# Altium schematic sheet GS_02_Pow.SchDoc: Title
size A3; Date: Date; CompanyName: Integrated Micro-Electronics Bulgaria; Organization: Design & Development Department; Address1: Drawing Type; Address2: Address 1; Address3: Address 2; Address4: Address 3; DocumentNumber: 730xxx; Revision: 01; SheetNumber: 1; SheetTotal: 1; PageSetup: Record=PageOptions|CenterHorizontal=True|CenterVertical=True|PrintScale=0.70|XCorrection=1.00|YCorrection=1.00|PrintKind=2|BorderSize=5000000|LeftOffset=0|BottomOffset=0|Orientation=2|PaperLength=1000|PaperWidth=1000|Scale=100|PaperSource=7|PrintQuality=-4|MediaType=1|DitherType=10|PaperKind=A4|PrintScaleMode=1; SheetSize: A3; Time: Time; ModifiedDate: Mod. Date
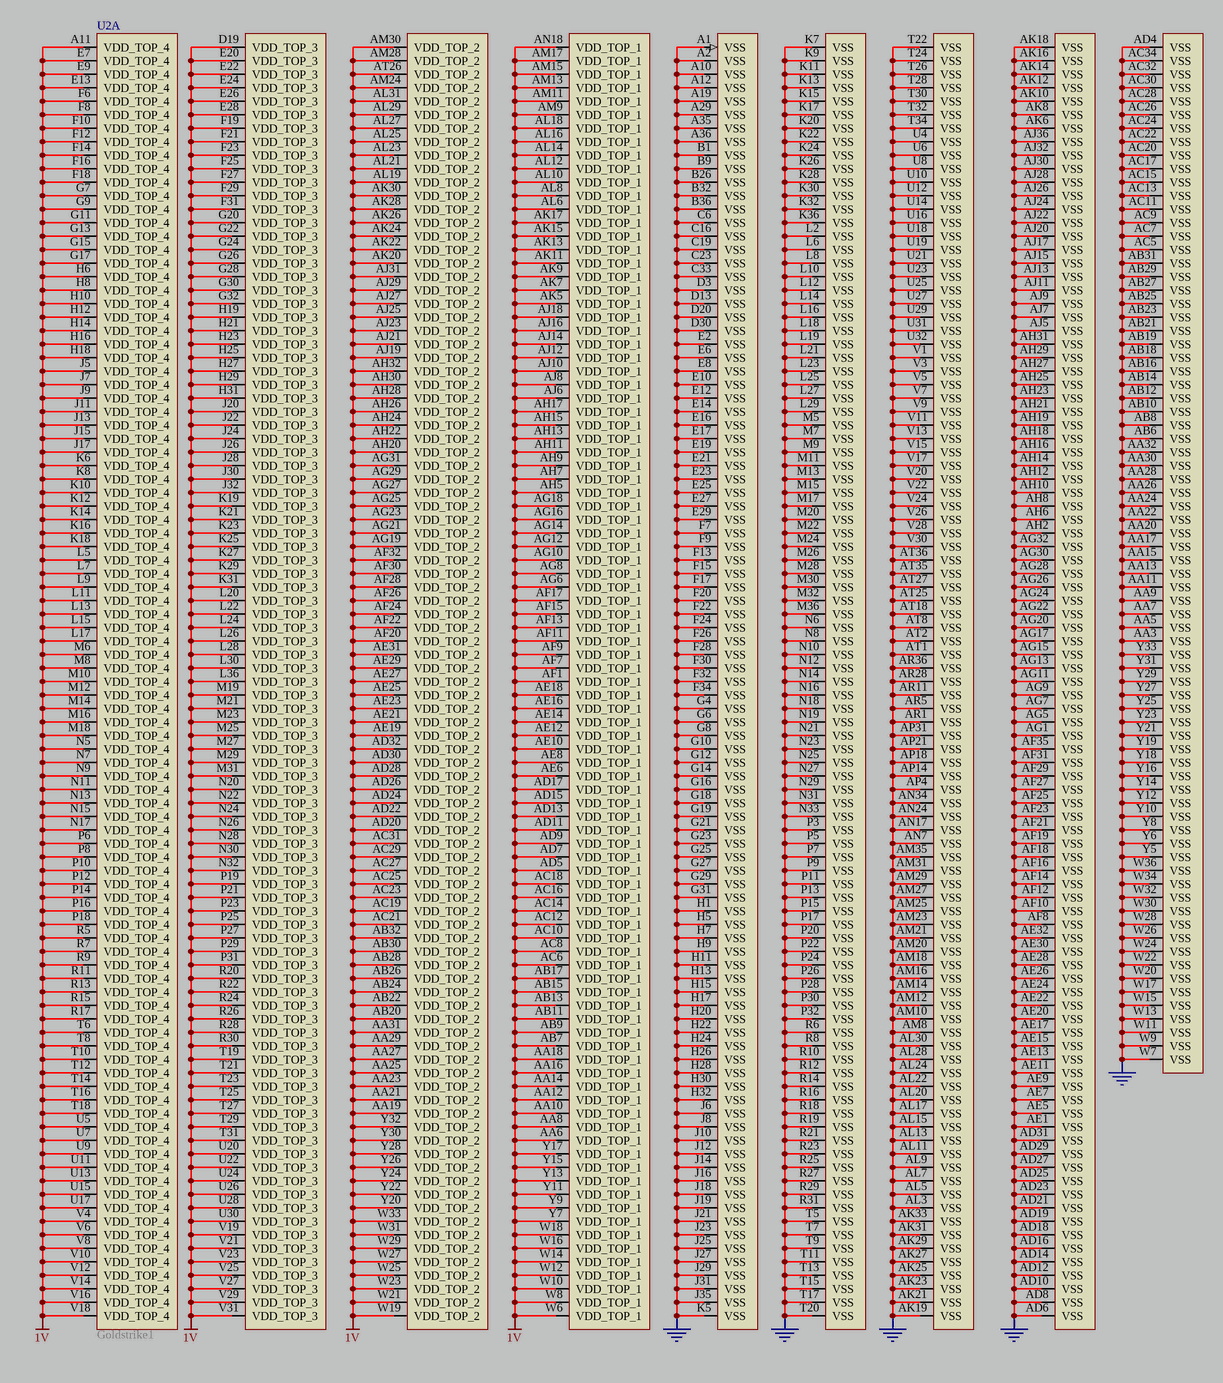
[diagram p0: GS_02_Pow.SchDoc]

## Parts
U2  Goldstrike1  (part A of 5)

## Nets
1V: U2.A11(VDD_TOP_4) U2.AA6(VDD_TOP_1) U2.AA8(VDD_TOP_1) U2.AA10(VDD_TOP_1) U2.AA12(VDD_TOP_1) U2.AA14(VDD_TOP_1) U2.AA16(VDD_TOP_1) U2.AA18(VDD_TOP_1) U2.AA19(VDD_TOP_2) U2.AA21(VDD_TOP_2) U2.AA23(VDD_TOP_2) U2.AA25(VDD_TOP_2) U2.AA27(VDD_TOP_2) U2.AA29(VDD_TOP_2) U2.AA31(VDD_TOP_2) U2.AB7(VDD_TOP_1) U2.AB9(VDD_TOP_1) U2.AB11(VDD_TOP_1) U2.AB13(VDD_TOP_1) U2.AB15(VDD_TOP_1) U2.AB17(VDD_TOP_1) U2.AB20(VDD_TOP_2) U2.AB22(VDD_TOP_2) U2.AB24(VDD_TOP_2) U2.AB26(VDD_TOP_2) U2.AB28(VDD_TOP_2) U2.AB30(VDD_TOP_2) U2.AB32(VDD_TOP_2) U2.AC6(VDD_TOP_1) U2.AC8(VDD_TOP_1) U2.AC10(VDD_TOP_1) U2.AC12(VDD_TOP_1) U2.AC14(VDD_TOP_1) U2.AC16(VDD_TOP_1) U2.AC18(VDD_TOP_1) U2.AC19(VDD_TOP_2) U2.AC21(VDD_TOP_2) U2.AC23(VDD_TOP_2) U2.AC25(VDD_TOP_2) U2.AC27(VDD_TOP_2) U2.AC29(VDD_TOP_2) U2.AC31(VDD_TOP_2) U2.AD5(VDD_TOP_1) U2.AD7(VDD_TOP_1) U2.AD9(VDD_TOP_1) U2.AD11(VDD_TOP_1) U2.AD13(VDD_TOP_1) U2.AD15(VDD_TOP_1) U2.AD17(VDD_TOP_1) U2.AD20(VDD_TOP_2) U2.AD22(VDD_TOP_2) U2.AD24(VDD_TOP_2) U2.AD26(VDD_TOP_2) U2.AD28(VDD_TOP_2) U2.AD30(VDD_TOP_2) U2.AD32(VDD_TOP_2) U2.AE6(VDD_TOP_1) U2.AE8(VDD_TOP_1) U2.AE10(VDD_TOP_1) U2.AE12(VDD_TOP_1) U2.AE14(VDD_TOP_1) U2.AE16(VDD_TOP_1) U2.AE18(VDD_TOP_1) U2.AE19(VDD_TOP_2) U2.AE21(VDD_TOP_2) U2.AE23(VDD_TOP_2) U2.AE25(VDD_TOP_2) U2.AE27(VDD_TOP_2) U2.AE29(VDD_TOP_2) U2.AE31(VDD_TOP_2) U2.AF1(VDD_TOP_1) U2.AF7(VDD_TOP_1) U2.AF9(VDD_TOP_1) U2.AF11(VDD_TOP_1) U2.AF13(VDD_TOP_1) U2.AF15(VDD_TOP_1) U2.AF17(VDD_TOP_1) U2.AF20(VDD_TOP_2) U2.AF22(VDD_TOP_2) U2.AF24(VDD_TOP_2) U2.AF26(VDD_TOP_2) U2.AF28(VDD_TOP_2) U2.AF30(VDD_TOP_2) U2.AF32(VDD_TOP_2) U2.AG6(VDD_TOP_1) U2.AG8(VDD_TOP_1) U2.AG10(VDD_TOP_1) U2.AG12(VDD_TOP_1) U2.AG14(VDD_TOP_1) U2.AG16(VDD_TOP_1) U2.AG18(VDD_TOP_1) U2.AG19(VDD_TOP_2) U2.AG21(VDD_TOP_2) U2.AG23(VDD_TOP_2) U2.AG25(VDD_TOP_2) U2.AG27(VDD_TOP_2) U2.AG29(VDD_TOP_2) U2.AG31(VDD_TOP_2) U2.AH5(VDD_TOP_1) U2.AH7(VDD_TOP_1) U2.AH9(VDD_TOP_1) U2.AH11(VDD_TOP_1) U2.AH13(VDD_TOP_1) U2.AH15(VDD_TOP_1) U2.AH17(VDD_TOP_1) U2.AH20(VDD_TOP_2) U2.AH22(VDD_TOP_2) U2.AH24(VDD_TOP_2) U2.AH26(VDD_TOP_2) U2.AH28(VDD_TOP_2) U2.AH30(VDD_TOP_2) U2.AH32(VDD_TOP_2) U2.AJ6(VDD_TOP_1) U2.AJ8(VDD_TOP_1) U2.AJ10(VDD_TOP_1) U2.AJ12(VDD_TOP_1) U2.AJ14(VDD_TOP_1) U2.AJ16(VDD_TOP_1) U2.AJ18(VDD_TOP_1) U2.AJ19(VDD_TOP_2) U2.AJ21(VDD_TOP_2) U2.AJ23(VDD_TOP_2) U2.AJ25(VDD_TOP_2) U2.AJ27(VDD_TOP_2) U2.AJ29(VDD_TOP_2) U2.AJ31(VDD_TOP_2) U2.AK5(VDD_TOP_1) U2.AK7(VDD_TOP_1) U2.AK9(VDD_TOP_1) U2.AK11(VDD_TOP_1) U2.AK13(VDD_TOP_1) U2.AK15(VDD_TOP_1) U2.AK17(VDD_TOP_1) U2.AK20(VDD_TOP_2) U2.AK22(VDD_TOP_2) U2.AK24(VDD_TOP_2) U2.AK26(VDD_TOP_2) U2.AK28(VDD_TOP_2) U2.AK30(VDD_TOP_2) U2.AL6(VDD_TOP_1) U2.AL8(VDD_TOP_1) U2.AL10(VDD_TOP_1) U2.AL12(VDD_TOP_1) U2.AL14(VDD_TOP_1) U2.AL16(VDD_TOP_1) U2.AL18(VDD_TOP_1) U2.AL19(VDD_TOP_2) U2.AL21(VDD_TOP_2) U2.AL23(VDD_TOP_2) U2.AL25(VDD_TOP_2) U2.AL27(VDD_TOP_2) U2.AL29(VDD_TOP_2) U2.AL31(VDD_TOP_2) U2.AM9(VDD_TOP_1) U2.AM11(VDD_TOP_1) U2.AM13(VDD_TOP_1) U2.AM15(VDD_TOP_1) U2.AM17(VDD_TOP_1) U2.AM24(VDD_TOP_2) U2.AM28(VDD_TOP_2) U2.AM30(VDD_TOP_2) U2.AN18(VDD_TOP_1) U2.AT26(VDD_TOP_2) U2.D19(VDD_TOP_3) U2.E7(VDD_TOP_4) U2.E9(VDD_TOP_4) U2.E13(VDD_TOP_4) U2.E20(VDD_TOP_3) U2.E22(VDD_TOP_3) U2.E24(VDD_TOP_3) U2.E26(VDD_TOP_3) U2.E28(VDD_TOP_3) U2.F6(VDD_TOP_4) U2.F8(VDD_TOP_4) U2.F10(VDD_TOP_4) U2.F12(VDD_TOP_4) U2.F14(VDD_TOP_4) U2.F16(VDD_TOP_4) U2.F18(VDD_TOP_4) U2.F19(VDD_TOP_3) U2.F21(VDD_TOP_3) U2.F23(VDD_TOP_3) U2.F25(VDD_TOP_3) U2.F27(VDD_TOP_3) U2.F29(VDD_TOP_3) U2.F31(VDD_TOP_3) U2.G7(VDD_TOP_4) U2.G9(VDD_TOP_4) U2.G11(VDD_TOP_4) U2.G13(VDD_TOP_4) U2.G15(VDD_TOP_4) U2.G17(VDD_TOP_4) U2.G20(VDD_TOP_3) U2.G22(VDD_TOP_3) U2.G24(VDD_TOP_3) U2.G26(VDD_TOP_3) U2.G28(VDD_TOP_3) U2.G30(VDD_TOP_3) U2.G32(VDD_TOP_3) U2.H6(VDD_TOP_4) U2.H8(VDD_TOP_4) U2.H10(VDD_TOP_4) U2.H12(VDD_TOP_4) U2.H14(VDD_TOP_4) U2.H16(VDD_TOP_4) U2.H18(VDD_TOP_4) U2.H19(VDD_TOP_3) U2.H21(VDD_TOP_3) U2.H23(VDD_TOP_3) U2.H25(VDD_TOP_3) U2.H27(VDD_TOP_3) U2.H29(VDD_TOP_3) U2.H31(VDD_TOP_3) U2.J5(VDD_TOP_4) U2.J7(VDD_TOP_4) U2.J9(VDD_TOP_4) U2.J11(VDD_TOP_4) U2.J13(VDD_TOP_4) U2.J15(VDD_TOP_4) U2.J17(VDD_TOP_4) U2.J20(VDD_TOP_3) U2.J22(VDD_TOP_3) U2.J24(VDD_TOP_3) U2.J26(VDD_TOP_3) U2.J28(VDD_TOP_3) U2.J30(VDD_TOP_3) U2.J32(VDD_TOP_3) U2.K6(VDD_TOP_4) U2.K8(VDD_TOP_4) U2.K10(VDD_TOP_4) U2.K12(VDD_TOP_4) U2.K14(VDD_TOP_4) U2.K16(VDD_TOP_4) U2.K18(VDD_TOP_4) U2.K19(VDD_TOP_3) U2.K21(VDD_TOP_3) U2.K23(VDD_TOP_3) U2.K25(VDD_TOP_3) U2.K27(VDD_TOP_3) U2.K29(VDD_TOP_3) U2.K31(VDD_TOP_3) U2.L5(VDD_TOP_4) U2.L7(VDD_TOP_4) U2.L9(VDD_TOP_4) U2.L11(VDD_TOP_4) U2.L13(VDD_TOP_4) U2.L15(VDD_TOP_4) U2.L17(VDD_TOP_4) U2.L20(VDD_TOP_3) U2.L22(VDD_TOP_3) U2.L24(VDD_TOP_3) U2.L26(VDD_TOP_3) U2.L28(VDD_TOP_3) U2.L30(VDD_TOP_3) U2.L36(VDD_TOP_3) U2.M6(VDD_TOP_4) U2.M8(VDD_TOP_4) U2.M10(VDD_TOP_4) U2.M12(VDD_TOP_4) U2.M14(VDD_TOP_4) U2.M16(VDD_TOP_4) U2.M18(VDD_TOP_4) U2.M19(VDD_TOP_3) U2.M21(VDD_TOP_3) U2.M23(VDD_TOP_3) U2.M25(VDD_TOP_3) U2.M27(VDD_TOP_3) U2.M29(VDD_TOP_3) U2.M31(VDD_TOP_3) U2.N5(VDD_TOP_4) U2.N7(VDD_TOP_4) U2.N9(VDD_TOP_4) U2.N11(VDD_TOP_4) U2.N13(VDD_TOP_4) U2.N15(VDD_TOP_4) U2.N17(VDD_TOP_4) U2.N20(VDD_TOP_3) U2.N22(VDD_TOP_3) U2.N24(VDD_TOP_3) U2.N26(VDD_TOP_3) U2.N28(VDD_TOP_3) U2.N30(VDD_TOP_3) U2.N32(VDD_TOP_3) U2.P6(VDD_TOP_4) U2.P8(VDD_TOP_4) U2.P10(VDD_TOP_4) U2.P12(VDD_TOP_4) U2.P14(VDD_TOP_4) U2.P16(VDD_TOP_4) U2.P18(VDD_TOP_4) U2.P19(VDD_TOP_3) U2.P21(VDD_TOP_3) U2.P23(VDD_TOP_3) U2.P25(VDD_TOP_3) U2.P27(VDD_TOP_3) U2.P29(VDD_TOP_3) U2.P31(VDD_TOP_3) U2.R5(VDD_TOP_4) U2.R7(VDD_TOP_4) U2.R9(VDD_TOP_4) U2.R11(VDD_TOP_4) U2.R13(VDD_TOP_4) U2.R15(VDD_TOP_4) U2.R17(VDD_TOP_4) U2.R20(VDD_TOP_3) U2.R22(VDD_TOP_3) U2.R24(VDD_TOP_3) U2.R26(VDD_TOP_3) U2.R28(VDD_TOP_3) U2.R30(VDD_TOP_3) U2.T6(VDD_TOP_4) U2.T8(VDD_TOP_4) U2.T10(VDD_TOP_4) U2.T12(VDD_TOP_4) U2.T14(VDD_TOP_4) U2.T16(VDD_TOP_4) U2.T18(VDD_TOP_4) U2.T19(VDD_TOP_3) U2.T21(VDD_TOP_3) U2.T23(VDD_TOP_3) U2.T25(VDD_TOP_3) U2.T27(VDD_TOP_3) U2.T29(VDD_TOP_3) U2.T31(VDD_TOP_3) U2.U5(VDD_TOP_4) U2.U7(VDD_TOP_4) U2.U9(VDD_TOP_4) U2.U11(VDD_TOP_4) U2.U13(VDD_TOP_4) U2.U15(VDD_TOP_4) U2.U17(VDD_TOP_4) U2.U20(VDD_TOP_3) U2.U22(VDD_TOP_3) U2.U24(VDD_TOP_3) U2.U26(VDD_TOP_3) U2.U28(VDD_TOP_3) U2.U30(VDD_TOP_3) U2.V4(VDD_TOP_4) U2.V6(VDD_TOP_4) U2.V8(VDD_TOP_4) U2.V10(VDD_TOP_4) U2.V12(VDD_TOP_4) U2.V14(VDD_TOP_4) U2.V16(VDD_TOP_4) U2.V18(VDD_TOP_4) U2.V19(VDD_TOP_3) U2.V21(VDD_TOP_3) U2.V23(VDD_TOP_3) U2.V25(VDD_TOP_3) U2.V27(VDD_TOP_3) U2.V29(VDD_TOP_3) U2.V31(VDD_TOP_3) U2.W6(VDD_TOP_1) U2.W8(VDD_TOP_1) U2.W10(VDD_TOP_1) U2.W12(VDD_TOP_1) U2.W14(VDD_TOP_1) U2.W16(VDD_TOP_1) U2.W18(VDD_TOP_1) U2.W19(VDD_TOP_2) U2.W21(VDD_TOP_2) U2.W23(VDD_TOP_2) U2.W25(VDD_TOP_2) U2.W27(VDD_TOP_2) U2.W29(VDD_TOP_2) U2.W31(VDD_TOP_2) U2.W33(VDD_TOP_2) U2.Y7(VDD_TOP_1) U2.Y9(VDD_TOP_1) U2.Y11(VDD_TOP_1) U2.Y13(VDD_TOP_1) U2.Y15(VDD_TOP_1) U2.Y17(VDD_TOP_1) U2.Y20(VDD_TOP_2) U2.Y22(VDD_TOP_2) U2.Y24(VDD_TOP_2) U2.Y26(VDD_TOP_2) U2.Y28(VDD_TOP_2) U2.Y30(VDD_TOP_2) U2.Y32(VDD_TOP_2)
GND: U2.A1(VSS) U2.A2(VSS) U2.A10(VSS) U2.A12(VSS) U2.A19(VSS) U2.A29(VSS) U2.A35(VSS) U2.A36(VSS) U2.AA3(VSS) U2.AA5(VSS) U2.AA7(VSS) U2.AA9(VSS) U2.AA11(VSS) U2.AA13(VSS) U2.AA15(VSS) U2.AA17(VSS) U2.AA20(VSS) U2.AA22(VSS) U2.AA24(VSS) U2.AA26(VSS) U2.AA28(VSS) U2.AA30(VSS) U2.AA32(VSS) U2.AB6(VSS) U2.AB8(VSS) U2.AB10(VSS) U2.AB12(VSS) U2.AB14(VSS) U2.AB16(VSS) U2.AB18(VSS) U2.AB19(VSS) U2.AB21(VSS) U2.AB23(VSS) U2.AB25(VSS) U2.AB27(VSS) U2.AB29(VSS) U2.AB31(VSS) U2.AC5(VSS) U2.AC7(VSS) U2.AC9(VSS) U2.AC11(VSS) U2.AC13(VSS) U2.AC15(VSS) U2.AC17(VSS) U2.AC20(VSS) U2.AC22(VSS) U2.AC24(VSS) U2.AC26(VSS) U2.AC28(VSS) U2.AC30(VSS) U2.AC32(VSS) U2.AC34(VSS) U2.AD4(VSS) U2.AD6(VSS) U2.AD8(VSS) U2.AD10(VSS) U2.AD12(VSS) U2.AD14(VSS) U2.AD16(VSS) U2.AD18(VSS) U2.AD19(VSS) U2.AD21(VSS) U2.AD23(VSS) U2.AD25(VSS) U2.AD27(VSS) U2.AD29(VSS) U2.AD31(VSS) U2.AE1(VSS) U2.AE5(VSS) U2.AE7(VSS) U2.AE9(VSS) U2.AE11(VSS) U2.AE13(VSS) U2.AE15(VSS) U2.AE17(VSS) U2.AE20(VSS) U2.AE22(VSS) U2.AE24(VSS) U2.AE26(VSS) U2.AE28(VSS) U2.AE30(VSS) U2.AE32(VSS) U2.AF8(VSS) U2.AF10(VSS) U2.AF12(VSS) U2.AF14(VSS) U2.AF16(VSS) U2.AF18(VSS) U2.AF19(VSS) U2.AF21(VSS) U2.AF23(VSS) U2.AF25(VSS) U2.AF27(VSS) U2.AF29(VSS) U2.AF31(VSS) U2.AF35(VSS) U2.AG1(VSS) U2.AG5(VSS) U2.AG7(VSS) U2.AG9(VSS) U2.AG11(VSS) U2.AG13(VSS) U2.AG15(VSS) U2.AG17(VSS) U2.AG20(VSS) U2.AG22(VSS) U2.AG24(VSS) U2.AG26(VSS) U2.AG28(VSS) U2.AG30(VSS) U2.AG32(VSS) U2.AH2(VSS) U2.AH6(VSS) U2.AH8(VSS) U2.AH10(VSS) U2.AH12(VSS) U2.AH14(VSS) U2.AH16(VSS) U2.AH18(VSS) U2.AH19(VSS) U2.AH21(VSS) U2.AH23(VSS) U2.AH25(VSS) U2.AH27(VSS) U2.AH29(VSS) U2.AH31(VSS) U2.AJ5(VSS) U2.AJ7(VSS) U2.AJ9(VSS) U2.AJ11(VSS) U2.AJ13(VSS) U2.AJ15(VSS) U2.AJ17(VSS) U2.AJ20(VSS) U2.AJ22(VSS) U2.AJ24(VSS) U2.AJ26(VSS) U2.AJ28(VSS) U2.AJ30(VSS) U2.AJ32(VSS) U2.AJ36(VSS) U2.AK6(VSS) U2.AK8(VSS) U2.AK10(VSS) U2.AK12(VSS) U2.AK14(VSS) U2.AK16(VSS) U2.AK18(VSS) U2.AK19(VSS) U2.AK21(VSS) U2.AK23(VSS) U2.AK25(VSS) U2.AK27(VSS) U2.AK29(VSS) U2.AK31(VSS) U2.AK33(VSS) U2.AL3(VSS) U2.AL5(VSS) U2.AL7(VSS) U2.AL9(VSS) U2.AL11(VSS) U2.AL13(VSS) U2.AL15(VSS) U2.AL17(VSS) U2.AL20(VSS) U2.AL22(VSS) U2.AL24(VSS) U2.AL28(VSS) U2.AL30(VSS) U2.AM8(VSS) U2.AM10(VSS) U2.AM12(VSS) U2.AM14(VSS) U2.AM16(VSS) U2.AM18(VSS) U2.AM20(VSS) U2.AM21(VSS) U2.AM23(VSS) U2.AM25(VSS) U2.AM27(VSS) U2.AM29(VSS) U2.AM31(VSS) U2.AM35(VSS) U2.AN7(VSS) U2.AN17(VSS) U2.AN24(VSS) U2.AN34(VSS) U2.AP4(VSS) U2.AP14(VSS) U2.AP18(VSS) U2.AP21(VSS) U2.AP31(VSS) U2.AR1(VSS) U2.AR5(VSS) U2.AR11(VSS) U2.AR28(VSS) U2.AR36(VSS) U2.AT1(VSS) U2.AT2(VSS) U2.AT8(VSS) U2.AT18(VSS) U2.AT25(VSS) U2.AT27(VSS) U2.AT35(VSS) U2.AT36(VSS) U2.B1(VSS) U2.B9(VSS) U2.B26(VSS) U2.B32(VSS) U2.B36(VSS) U2.C6(VSS) U2.C16(VSS) U2.C19(VSS) U2.C23(VSS) U2.C33(VSS) U2.D3(VSS) U2.D13(VSS) U2.D20(VSS) U2.D30(VSS) U2.E2(VSS) U2.E6(VSS) U2.E8(VSS) U2.E10(VSS) U2.E12(VSS) U2.E14(VSS) U2.E16(VSS) U2.E17(VSS) U2.E19(VSS) U2.E21(VSS) U2.E23(VSS) U2.E25(VSS) U2.E27(VSS) U2.E29(VSS) U2.F7(VSS) U2.F9(VSS) U2.F13(VSS) U2.F15(VSS) U2.F17(VSS) U2.F20(VSS) U2.F22(VSS) U2.F24(VSS) U2.F26(VSS) U2.F28(VSS) U2.F30(VSS) U2.F32(VSS) U2.F34(VSS) U2.G4(VSS) U2.G6(VSS) U2.G8(VSS) U2.G10(VSS) U2.G12(VSS) U2.G14(VSS) U2.G16(VSS) U2.G18(VSS) U2.G19(VSS) U2.G21(VSS) U2.G23(VSS) U2.G25(VSS) U2.G27(VSS) U2.G29(VSS) U2.G31(VSS) U2.H1(VSS) U2.H5(VSS) U2.H7(VSS) U2.H9(VSS) U2.H11(VSS) U2.H13(VSS) U2.H15(VSS) U2.H17(VSS) U2.H20(VSS) U2.H22(VSS) U2.H24(VSS) U2.H26(VSS) U2.H28(VSS) U2.H30(VSS) U2.H32(VSS) U2.J6(VSS) U2.J8(VSS) U2.J10(VSS) U2.J12(VSS) U2.J14(VSS) U2.J16(VSS) U2.J18(VSS) U2.J19(VSS) U2.J21(VSS) U2.J23(VSS) U2.J25(VSS) U2.J27(VSS) U2.J29(VSS) U2.J31(VSS) U2.J35(VSS) U2.K5(VSS) U2.K7(VSS) U2.K9(VSS) U2.K11(VSS) U2.K13(VSS) U2.K15(VSS) U2.K17(VSS) U2.K20(VSS) U2.K22(VSS) U2.K24(VSS) U2.K26(VSS) U2.K28(VSS) U2.K30(VSS) U2.K32(VSS) U2.K36(VSS) U2.L2(VSS) U2.L6(VSS) U2.L8(VSS) U2.L10(VSS) U2.L12(VSS) U2.L14(VSS) U2.L16(VSS) U2.L18(VSS) U2.L19(VSS) U2.L21(VSS) U2.L23(VSS) U2.L25(VSS) U2.L27(VSS) U2.L29(VSS) U2.M5(VSS) U2.M7(VSS) U2.M9(VSS) U2.M11(VSS) U2.M13(VSS) U2.M15(VSS) U2.M17(VSS) U2.M20(VSS) U2.M22(VSS) U2.M24(VSS) U2.M26(VSS) U2.M28(VSS) U2.M30(VSS) U2.M32(VSS) U2.M36(VSS) U2.N6(VSS) U2.N8(VSS) U2.N10(VSS) U2.N12(VSS) U2.N14(VSS) U2.N16(VSS) U2.N18(VSS) U2.N19(VSS) U2.N21(VSS) U2.N23(VSS) U2.N25(VSS) U2.N27(VSS) U2.N29(VSS) U2.N31(VSS) U2.N33(VSS) U2.P3(VSS) U2.P5(VSS) U2.P7(VSS) U2.P9(VSS) U2.P11(VSS) U2.P13(VSS) U2.P15(VSS) U2.P17(VSS) U2.P20(VSS) U2.P22(VSS) U2.P24(VSS) U2.P26(VSS) U2.P28(VSS) U2.P30(VSS) U2.P32(VSS) U2.R6(VSS) U2.R8(VSS) U2.R10(VSS) U2.R12(VSS) U2.R14(VSS) U2.R16(VSS) U2.R18(VSS) U2.R19(VSS) U2.R21(VSS) U2.R23(VSS) U2.R25(VSS) U2.R27(VSS) U2.R29(VSS) U2.R31(VSS) U2.T5(VSS) U2.T7(VSS) U2.T9(VSS) U2.T11(VSS) U2.T13(VSS) U2.T15(VSS) U2.T17(VSS) U2.T20(VSS) U2.T22(VSS) U2.T24(VSS) U2.T26(VSS) U2.T28(VSS) U2.T30(VSS) U2.T32(VSS) U2.T34(VSS) U2.U4(VSS) U2.U6(VSS) U2.U8(VSS) U2.U10(VSS) U2.U12(VSS) U2.U14(VSS) U2.U16(VSS) U2.U18(VSS) U2.U19(VSS) U2.U21(VSS) U2.U23(VSS) U2.U25(VSS) U2.U27(VSS) U2.U29(VSS) U2.U31(VSS) U2.U32(VSS) U2.V1(VSS) U2.V3(VSS) U2.V5(VSS) U2.V7(VSS) U2.V9(VSS) U2.V11(VSS) U2.V13(VSS) U2.V15(VSS) U2.V17(VSS) U2.V20(VSS) U2.V22(VSS) U2.V24(VSS) U2.V26(VSS) U2.V28(VSS) U2.V30(VSS) U2.W7(VSS) U2.W9(VSS) U2.W11(VSS) U2.W13(VSS) U2.W15(VSS) U2.W17(VSS) U2.W20(VSS) U2.W22(VSS) U2.W24(VSS) U2.W26(VSS) U2.W28(VSS) U2.W30(VSS) U2.W32(VSS) U2.W34(VSS) U2.W36(VSS) U2.Y5(VSS) U2.Y6(VSS) U2.Y8(VSS) U2.Y10(VSS) U2.Y12(VSS) U2.Y14(VSS) U2.Y16(VSS) U2.Y18(VSS) U2.Y19(VSS) U2.Y21(VSS) U2.Y23(VSS) U2.Y25(VSS) U2.Y27(VSS) U2.Y29(VSS) U2.Y31(VSS) U2.Y33(VSS)

## Notes on the sheet
- Block Name
- Document Type: Schematic
- Size
- File Name
- Variant
- Rev.
- Project Name
- Sheet
- /